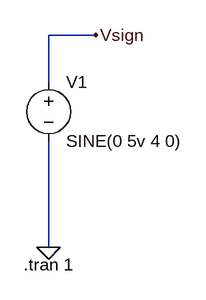
[diagram p0: schematic aula1.9.1.asc]
aula1.9.1.asc, the LTspice schematic file:
Version 4
SHEET 1 880 680
WIRE 160 64 96 64
WIRE 96 128 96 64
WIRE 96 352 96 208
FLAG 160 64 Vsign
FLAG 96 352 0
SYMBOL voltage 96 112 R0
WINDOW 123 0 0 Left 0
WINDOW 39 0 0 Left 0
SYMATTR InstName V1
SYMATTR Value SINE(0 5v 4 0)
TEXT 62 376 Left 2 !.tran 1

The netlist it stands for:
* aula1.9.1.asc
V1 Vsign 0 SINE(0 5v 4 0)
.tran 1
.backanno
.end

* Results of the author's LTspice run, read from the files saved beside the schematic
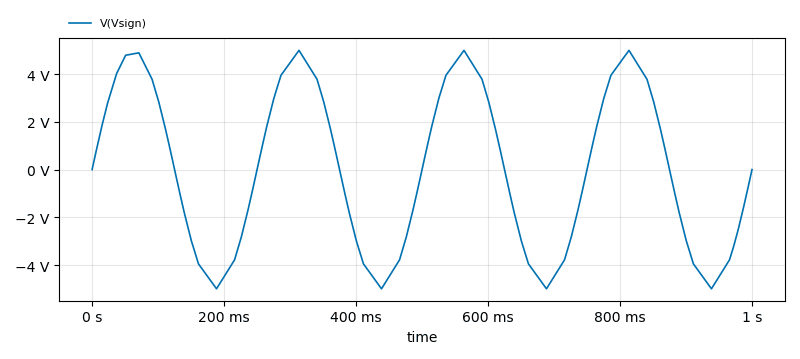
[diagram p1: Transient Analysis of aula1.9.1.asc, plotted from the saved traces]
* Transient Analysis, 1 run:
*   V(Vsign): min -4.992 V, max 4.992 V, average 5.236 mV, rms 3.456 V, last 0 V